# EAGLE design 3x3Bottom (EAGLE 7.3.0)
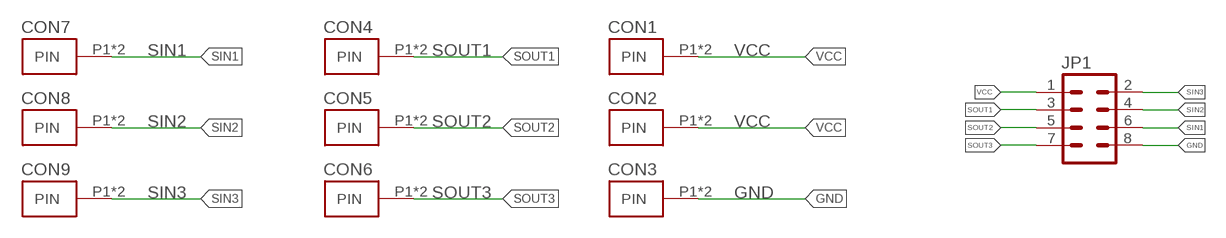
[diagram p0: schematic, sheet 1]

## Parts
CON1  SHIELD_FINGER0820  [SHIELD_FINGER_PKG]
CON2  SHIELD_FINGER0820  [SHIELD_FINGER_PKG]
CON3  SHIELD_FINGER0820  [SHIELD_FINGER_PKG]
CON4  SHIELD_FINGER0820  [SHIELD_FINGER_PKG]
CON5  SHIELD_FINGER0820  [SHIELD_FINGER_PKG]
CON6  SHIELD_FINGER0820  [SHIELD_FINGER_PKG]
CON7  SHIELD_FINGER0820  [SHIELD_FINGER_PKG]
CON8  SHIELD_FINGER0820  [SHIELD_FINGER_PKG]
CON9  SHIELD_FINGER0820  [SHIELD_FINGER_PKG]
JP1  M04X2_0.1"  [M04X2_0.1"_PADS]

## Nets
GND: CON3.P1(PIN) CON3.P2(PIN) JP1.8
SIN1: CON7.P1(PIN) CON7.P2(PIN) JP1.6
SIN2: CON8.P1(PIN) CON8.P2(PIN) JP1.4
SIN3: CON9.P1(PIN) CON9.P2(PIN) JP1.2
SOUT1: CON4.P1(PIN) CON4.P2(PIN) JP1.3
SOUT2: CON5.P1(PIN) CON5.P2(PIN) JP1.5
SOUT3: CON6.P1(PIN) CON6.P2(PIN) JP1.7
VCC: CON1.P1(PIN) CON1.P2(PIN) CON2.P1(PIN) CON2.P2(PIN) JP1.1

## Library data of the parts
CON1-CON9 = MakerShoe:SHIELD_FINGER
JP1 = MakerWear:M04X2_0.1": .1" header, two rows of four.

## Board
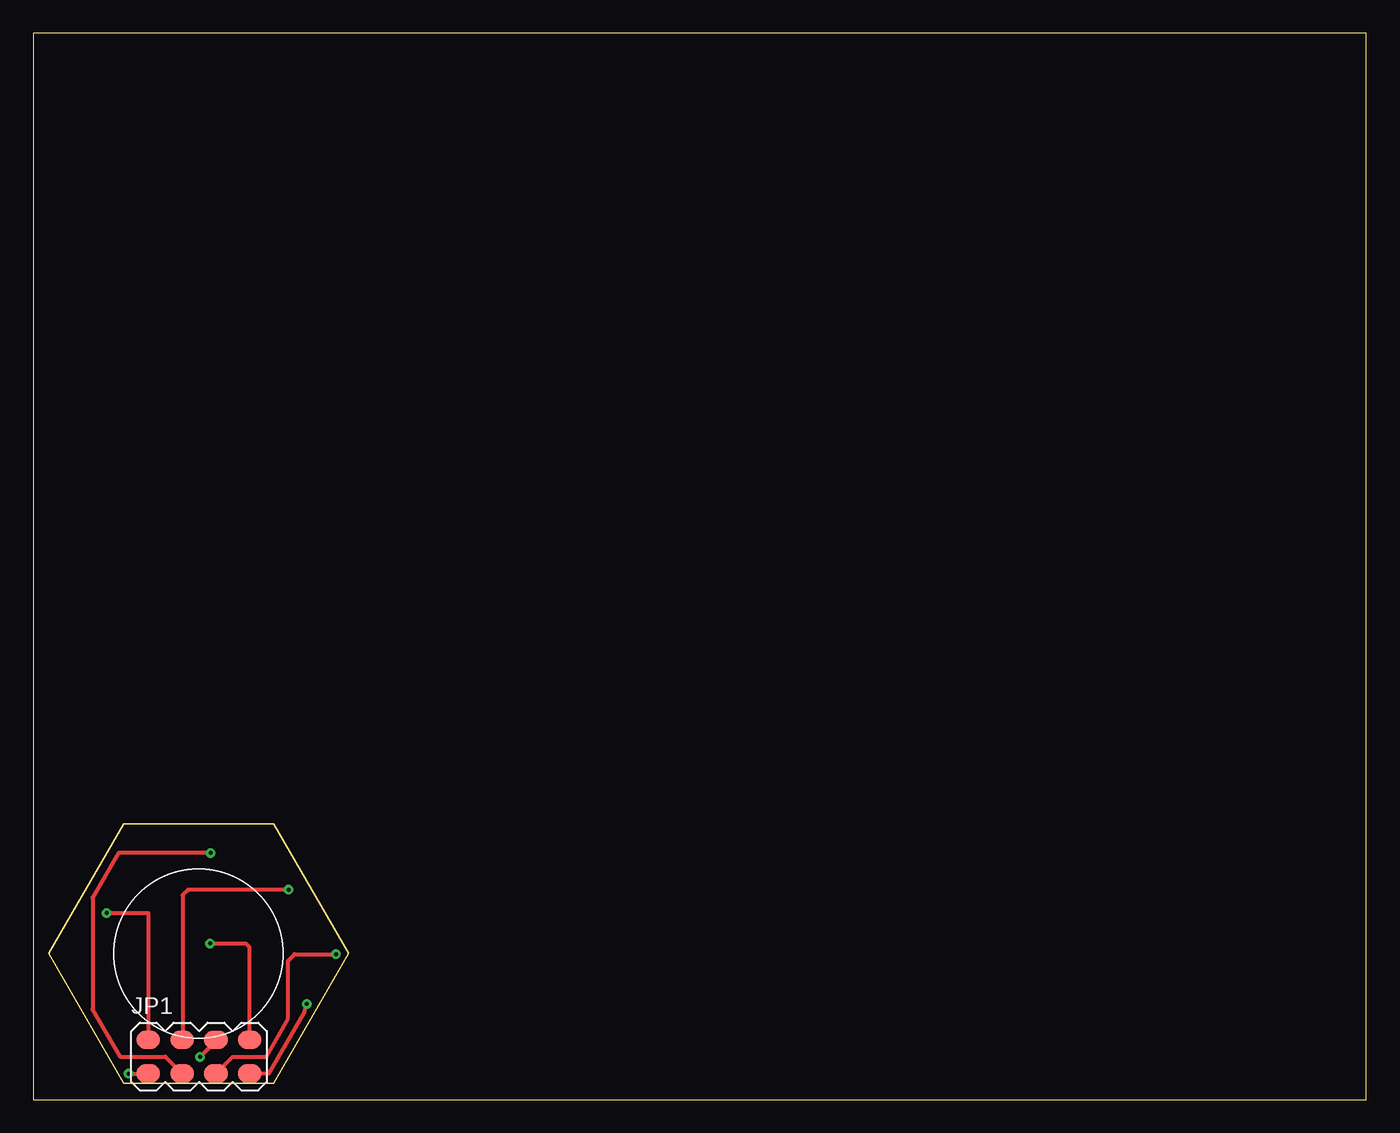
[diagram p1: board, top side]
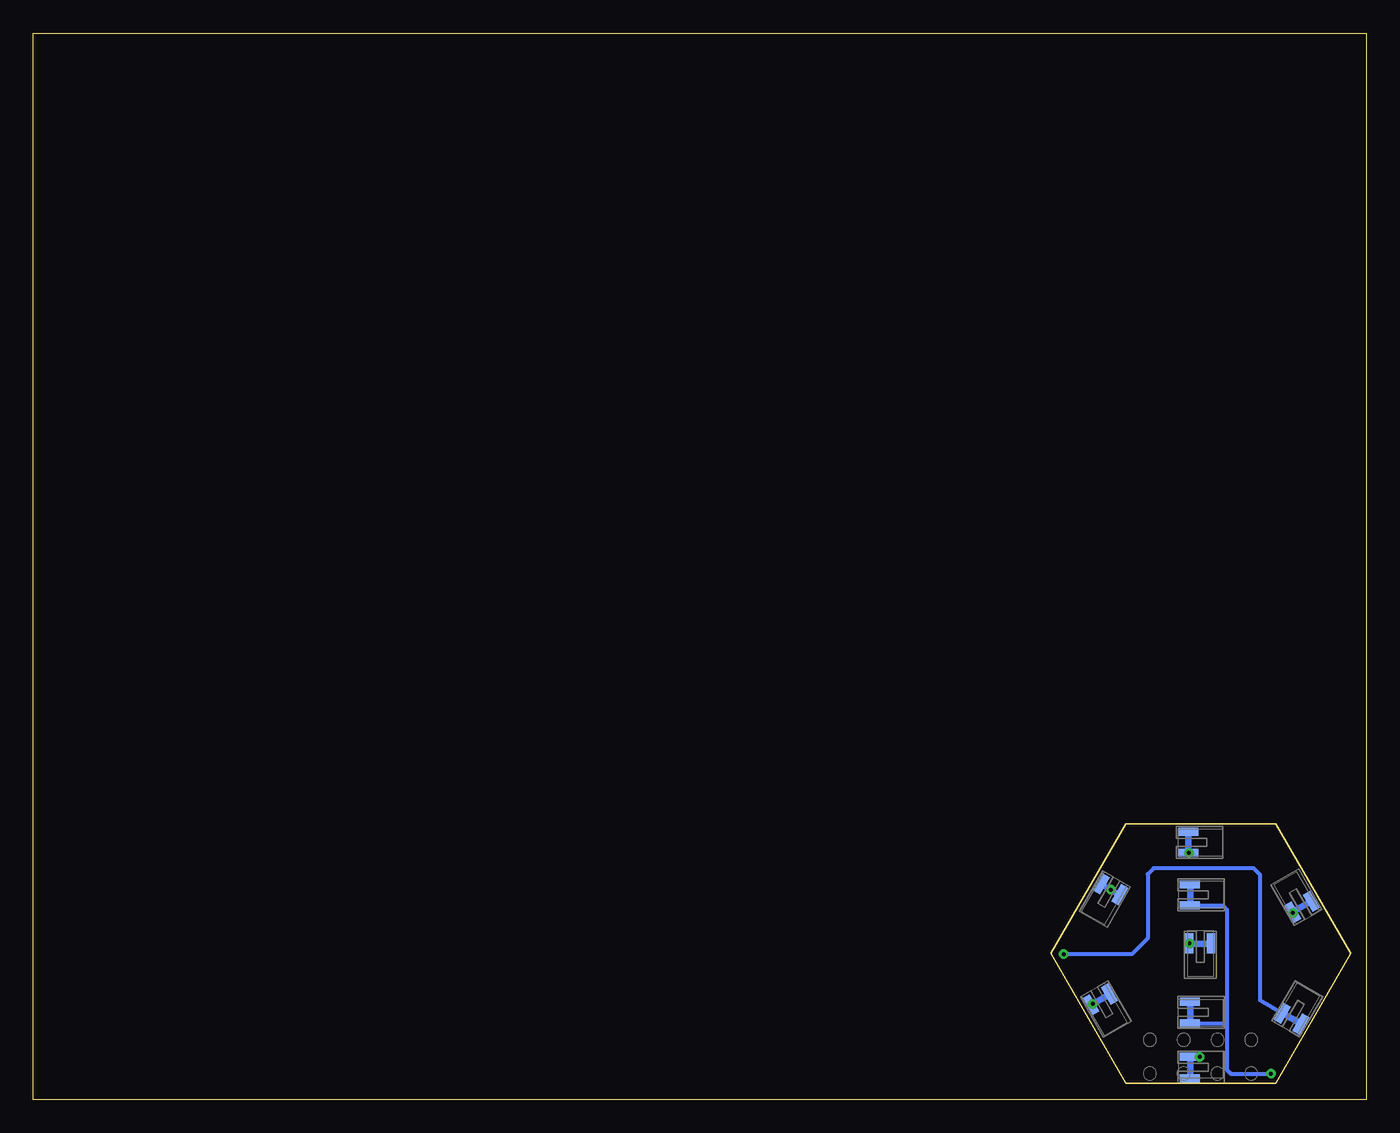
[diagram p2: board, bottom side, seen from below]

Size 100 x 80 mm. Coordinates in mm from the lower left corner, seen from the top.
Outline: 0,0 100,0 100,80 0,80 0,0
Outline: 18.04,20.69 23.67,10.95 18.04,1.21 6.79,1.21 1.17,10.95 6.79,20.69 18.04,20.69
Copper layers (1*16): Top 0.035mm / dielectric 1.5mm / Bottom 0.035mm
Design rules "default": minimum track width 10mil, minimum drill 24mil, track to track 8mil, track to pad 8mil, pad to pad 8mil, via to via 8mil, smd to smd 8mil, copper to edge 40mil, drill to drill 8mil, minimum pad ring 10mil, minimum via ring 8mil, stop-mask expansion 4mil, vias tented up to drill 0mil, thermal gap 10mil

### Footprints (pad centres in the part's own frame; a part is rotated, then mirrored left to right if it is on the bottom)
SHIELD_FINGER_PKG = smd 1.5 x 0.6 bottom: P1 0.025,0.787; P2 0.025,-0.813
M04X2_0.1"_PADS = smd 1.778 x 1.397: 1 -3.81,-1.27; 2 -3.81,1.27; 3 -1.27,-1.27; 4 -1.27,1.27; 5 1.27,-1.27; 6 1.27,1.27; 7 3.81,-1.27; 8 3.81,1.27

### Placement (x,y rotation side)
CON1  13.21,6.54 0 top
CON2  13.21,15.37 0 top
CON3  12.45,11.68 90 top
CON4  13.34,19.3 0 top
CON5  5.59,6.1 300 top
CON6  19.94,7.49 60 top
CON7  13.21,2.41 0 top
CON8  19.18,15.75 120 top
CON9  4.83,14.48 240 top
JP1  12.43,3.22 0 top

### Tracks (layer width: path | path; a pad name or v marks a point on that pad's centre or on a via)
GND  (via drill 0.3)
  Top 0.305: CON3.P2 15.94,11.71 16.2,11.45 16.2,4.53 JP1.8
  Bottom 0.305: CON3.P2 CON3.P1
  other vias: 13.26,11.71
SIN1  (via drill 0.3)
  Top 0.305: v12.5,3.2 13.35,4.05 13.35,4.14 JP1.6
  Bottom 0.305: CON7.P2 CON7.P1 v12.5,3.2 | v12.5,3.2
SIN2  (via drill 0.3)
  Top 0.305: v19.15,15.75 11.6,15.75 11.2,15.35 11.2,4.53 JP1.4
  Bottom 0.305: CON8.P2 CON8.P1 18.78,15.38 v19.15,15.75
SIN3  (via drill 0.3)
  Top 0.305: v5.5,14 8.62,14 JP1.2
  Bottom 0.305: CON9.P2 CON9.P1 v5.5,14
SOUT1  (via drill 0.3)
  Top 0.305: v13.3,18.5 6.4,18.5 4.45,15.15 4.45,6.75 6.5,3.21 9.9,3.21 JP1.3
  Bottom 0.305: CON4.P1 CON4.P2 v13.31,18.49 v13.3,18.5
SOUT2  (via drill 0.3)
  Top 0.305: v22.7,10.9 19.6,10.9 19.1,10.4 19.1,6.1 17.45,3.2 14.95,3.2 JP1.5
  Bottom 0.305: CON5.P2 CON5.P1 | CON5.P1 6.42,6.47 | v22.7,10.9 17.6,10.9 16.4,12.1 16.4,16.9 15.95,17.35 8.45,17.35 7.95,16.85 7.95,7.45 CON5.P1
SOUT3  (via drill 0.3)
  Top 0.305: JP1.7 17.65,1.95 20.35,6.6 v20.51,7.17
  Bottom 0.305: CON6.P2 CON6.P1 v20.51,7.17
VCC  (via drill 0.3)
  Top 0.305: v7.15,1.95 JP1.1
  Bottom 0.305: CON1.P1 CON1.P2 10.58,5.73 10.45,5.6 | CON2.P1 CON2.P2 10.75,14.55 10.45,14.25 10.45,5.6 | 10.45,5.6 10.45,2.25 10.15,1.95 v7.15,1.95